# Altium schematic sheet USB-PD.SchDoc
size 431 x 279 mm; Organization: ORGANIZATION; Address1: ADDRESS 1; Address2: ADDRESS 2; Address3: ADDRESS 3; Address4: ADDRESS 4; Revision: -; SheetNumber: 2; SheetTotal: 8; ENG_APP_DATE: --/--/--; DSN_APP_DATE: --/--/--; CHK_APP_DATE: --/--/--; SPICEModelCacheGEHPRBHI: <root> / <DocumentId>GEHPRBHI</DocumentId> / </root>
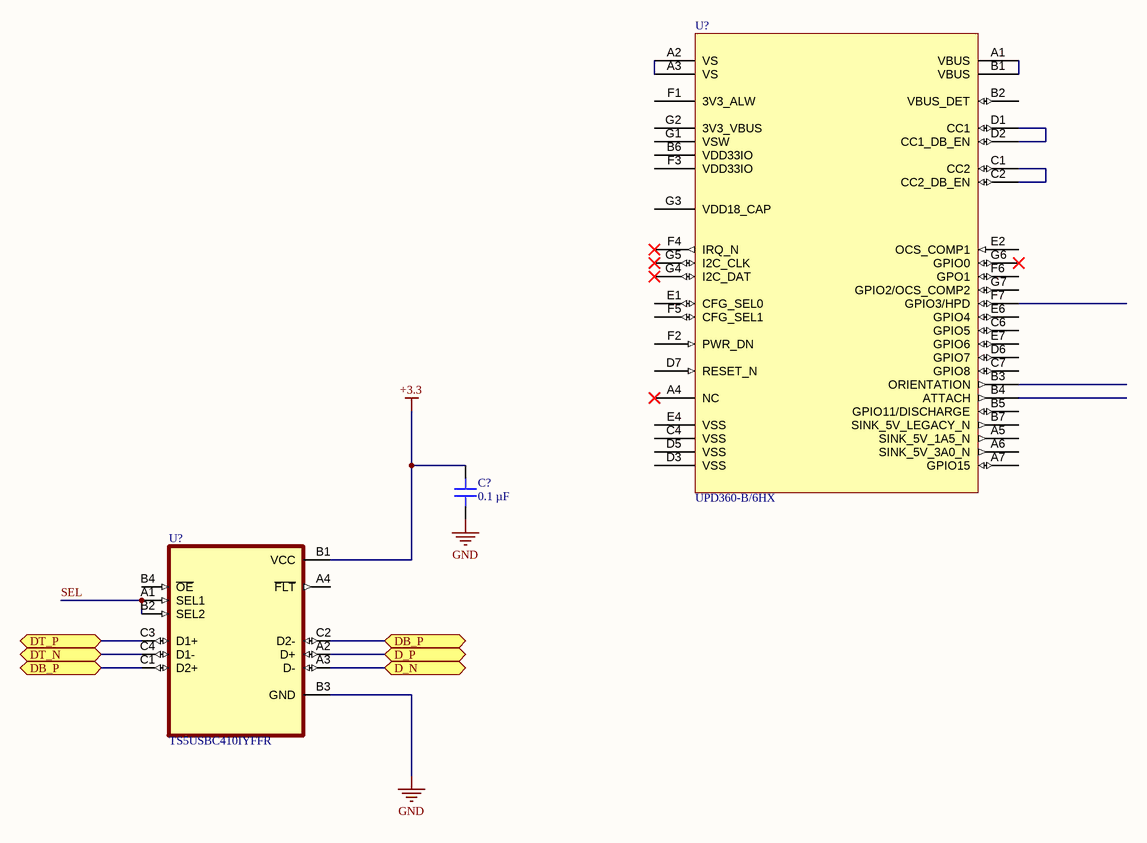
[diagram p0: USB-PD.SchDoc]

## Parts
(Parts that share a designator on the sheet are numbered #1, #2 ... from top to bottom, then left to right.)
C?  0.1 µF  [CAP 0201_0603]
U?#1  UPD360-B/6HX  [BGA44C50P7X7_400X400X80]
U?#2  TS5USBC410IYFFR  [BGA12N40P3X4_119X159X62N]

## Ports
D_N (bidir), D_P (bidir), DB_P (bidir), DT_N (bidir), DT_P (bidir)

## Nets
+3.3: C?.2 U?#2.B1(VCC)
GND: C?.1 U?#2.B3(GND)
D_N: U?#2.A3(D-) ; port D_N
D_P: U?#2.A2(D+) ; port D_P
DB_P: U?#2.C1(D2+) U?#2.C2(D2-) ; port DB_P
DT_N: U?#2.C4(D1-) ; port DT_N
DT_P: U?#2.C3(D1+) ; port DT_P
SEL: U?#2.A1(SEL1) U?#2.B2(SEL2)
NetU?#1_A1: U?#1.A1(VBUS) U?#1.B1(VBUS)
NetU?#1_A2: U?#1.A2(VS) U?#1.A3(VS)
NetU?#1_C1: U?#1.C1(CC2) U?#1.C2(CC2_DB_EN)
NetU?#1_D1: U?#1.D1(CC1) U?#1.D2(CC1_DB_EN)

Not connected (* = marked no-connect by the designer): U?#1 A4(NC)* A5(SINK_5V_1A5_N) A6(SINK_5V_3A0_N) A7(GPIO15) B2(VBUS_DET) B3(ORIENTATION) B4(ATTACH) B5(GPIO11/DISCHARGE) B6(VDD33IO) B7(SINK_5V_LEGACY_N) C4(VSS) C6(GPIO5) C7(GPIO8) D3(VSS) D5(VSS) D6(GPIO7) D7(RESET_N) E1(CFG_SEL0) E2(OCS_COMP1) E4(VSS) E6(GPIO4) E7(GPIO6) F1(3V3_ALW) F2(PWR_DN) F3(VDD33IO) F4(IRQ_N)* F5(CFG_SEL1) F6(GPO1) F7(GPIO3/HPD) G1(VSW) G2(3V3_VBUS) G3(VDD18_CAP) G4(I2C_DAT)* G5(I2C_CLK)* G6(GPIO0)* G7(GPIO2/OCS_COMP2); U?#2 A4(~{FLT}) B4(~{OE})

## Notes on the sheet
- DWG. NO.
- REV.
- SHT.
- REVISION
- DESCRIPTION
- DATE
- APPROVED
- ENG:
- APPROVALS
- PROJECT
- DSN:
- CHK:
- REFERENCE DOCUMENTS
- PROJECT REVISION:
- TITLE
- SimulaVR
- DOCUMENT REVISION:
- DESIGN ITEM:
- BOM:
- FAB DWG:
- PCB DWG:
- ASSY DWG:
- SCALE:
- SIZE
- B
- CAGE CODE
- FILE NAME
- DWG NO.
- SHEET
- OF
- REV

## Library data of the parts
C? = GRM033R61A104KE15D: CAP CER 0.1UF 10V X5R 0201; manufacturer: Murata Electronics; Tolerance: ±10%; Part Number: GRM033R61A104KE15D; Value: 0.1 µF; Applications: General Purpose; Capacitance: 0.1 µF; componentlink1description: Datasheet; componentlink1url: https://www.murata.com/~/media/webrenewal/support/library/catalog/products/capacitor/mlcc/c02e.ashx?la=en-us; componentlink2description: DigiKey Link; componentlink2url: https://www.digikey.com/en/products/detail/murata-electronics/GRM033R61A104KE15D/2269163; Device Package: 0201 (0603 Metric); lastupdated: 3/17/2022 8:21:28 AM; Lifecycle Status: Active; Minimum Order: 1; Mounting Type: Surface Mount, MLCC; Operating Temperature: -55°C ~ 85°C; Package / Case: 0201 (0603 Metric); packaging: CutTape; partid: 1641; Part Status: Active; price: 0.01; series: GRM; Size / Dimension: 0.024" L x 0.012" W (0.60mm x 0.30mm); Supplier 1: DigiKey; Supplier Part Number 1: 490-5881-1-ND; Temperature Coefficient: X5R; Thickness (Max): 0.013" (0.33mm); Voltage - Rated: 10V
U?#1 = CMP-015-00011-2: Full Speed/High Speed/Super Speed Port Control With Power Delivery USB 2.0 5V Tray 44-Pin WFBGA
U?#2 = TS5USBC410IYFFR: MF: {'manufacturer': u'Texas Instruments'}; MP: TS5USBC410IYFFR; Package: None; Price: None; Availability: Unavailable; Value: *